# EAGLE schematic schematic (EAGLE 9.7.0)
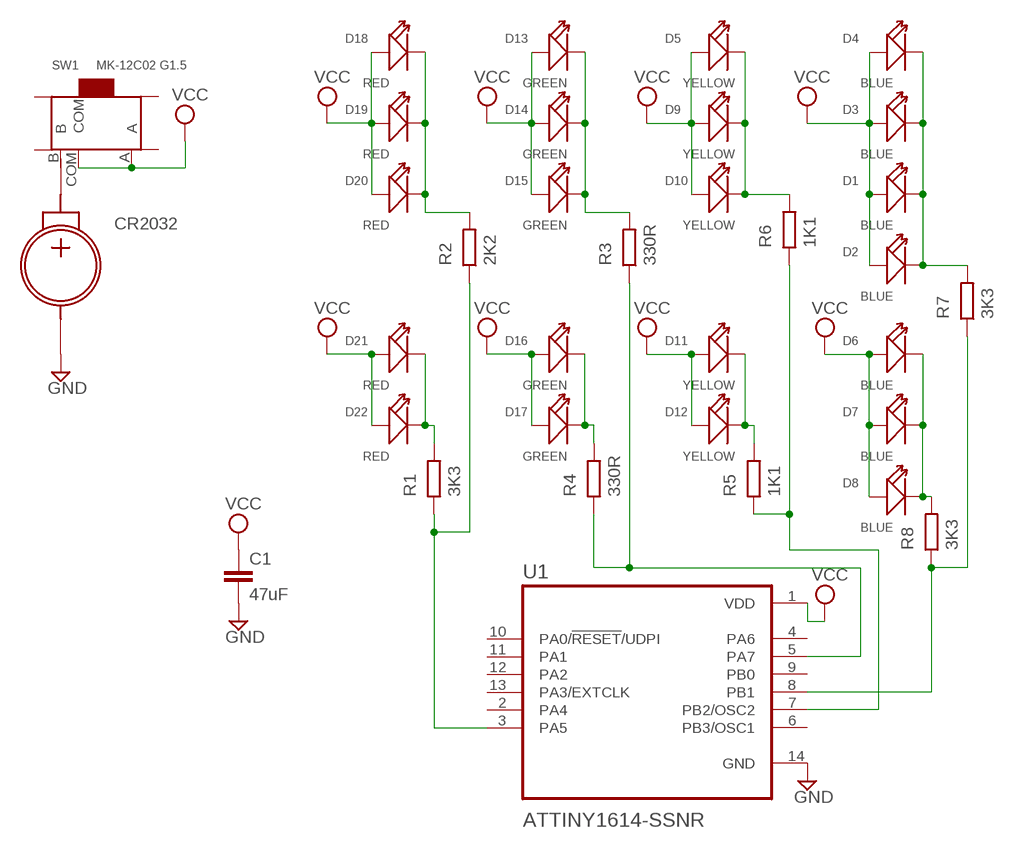
[diagram p0: schematic, sheet 1]

## Parts
C1  47uF  C-EUC1206  [C1206]
CR2032  BS-7CR2032_COIN_CELL_BATTERY_HOLDER  [BS-7]
D1  BLUE  DIP-LED-GREEN-GREEN(2P-D3MM)  [LED2-2.54-D3.0MM]
D2  BLUE  DIP-LED-GREEN-GREEN(2P-D3MM)  [LED2-2.54-D3.0MM]
D3  BLUE  DIP-LED-GREEN-GREEN(2P-D3MM)  [LED2-2.54-D3.0MM]
D4  BLUE  DIP-LED-GREEN-GREEN(2P-D3MM)  [LED2-2.54-D3.0MM]
D5  YELLOW  DIP-LED-GREEN-GREEN(2P-D3MM)  [LED2-2.54-D3.0MM]
D6  BLUE  DIP-LED-GREEN-GREEN(2P-D3MM)  [LED2-2.54-D3.0MM]
D7  BLUE  DIP-LED-GREEN-GREEN(2P-D3MM)  [LED2-2.54-D3.0MM]
D8  BLUE  DIP-LED-GREEN-GREEN(2P-D3MM)  [LED2-2.54-D3.0MM]
D9  YELLOW  DIP-LED-GREEN-GREEN(2P-D3MM)  [LED2-2.54-D3.0MM]
D10  YELLOW  DIP-LED-GREEN-GREEN(2P-D3MM)  [LED2-2.54-D3.0MM]
D11  YELLOW  DIP-LED-GREEN-GREEN(2P-D3MM)  [LED2-2.54-D3.0MM]
D12  YELLOW  DIP-LED-GREEN-GREEN(2P-D3MM)  [LED2-2.54-D3.0MM]
D13  GREEN  DIP-LED-GREEN-GREEN(2P-D3MM)  [LED2-2.54-D3.0MM]
D14  GREEN  DIP-LED-GREEN-GREEN(2P-D3MM)  [LED2-2.54-D3.0MM]
D15  GREEN  DIP-LED-GREEN-GREEN(2P-D3MM)  [LED2-2.54-D3.0MM]
D16  GREEN  DIP-LED-GREEN-GREEN(2P-D3MM)  [LED2-2.54-D3.0MM]
D17  GREEN  DIP-LED-GREEN-GREEN(2P-D3MM)  [LED2-2.54-D3.0MM]
D18  RED  DIP-LED-GREEN-GREEN(2P-D3MM)  [LED2-2.54-D3.0MM]
D19  RED  DIP-LED-GREEN-GREEN(2P-D3MM)  [LED2-2.54-D3.0MM]
D20  RED  DIP-LED-GREEN-GREEN(2P-D3MM)  [LED2-2.54-D3.0MM]
D21  RED  DIP-LED-GREEN-GREEN(2P-D3MM)  [LED2-2.54-D3.0MM]
D22  RED  DIP-LED-GREEN-GREEN(2P-D3MM)  [LED2-2.54-D3.0MM]
R1  3K3  R_AXIAL-7.2MM-PITCH  [RESAD724W46L381D178B]
R2  2K2  R_AXIAL-7.2MM-PITCH  [RESAD724W46L381D178B]
R3  330R  R_AXIAL-7.2MM-PITCH  [RESAD724W46L381D178B]
R4  330R  R_AXIAL-7.2MM-PITCH  [RESAD724W46L381D178B]
R5  1K1  R_AXIAL-7.2MM-PITCH  [RESAD724W46L381D178B]
R6  1K1  R_AXIAL-7.2MM-PITCH  [RESAD724W46L381D178B]
R7  3K3  R_AXIAL-7.2MM-PITCH  [RESAD724W46L381D178B]
R8  3K3  R_AXIAL-7.2MM-PITCH  [RESAD724W46L381D178B]
SW1  MK-12C02 G1.5  SMD-TOGGLE-SWITCH-ON-ON(3+4P-6.7X2.7MM)  [SW7-SMD-L6.7X2.7X3.2MM]
U1  ATTINY1614-SSNR  [SOIC127P600X175-14N]

## Nets
GND: C1.2 CR2032.NEG U1.14(GND)
N$1: D13.K(-) D14.K(-) D15.K(-) R3.2
N$2: D21.K(-) D22.K(-) R1.2
N$3: R1.1 R2.1 U1.3(PA5)
N$4: D18.K(-) D19.K(-) D20.K(-) R2.2
N$5: R3.1 R4.1 U1.5(PA7)
N$6: D16.K(-) D17.K(-) R4.2
N$7: D5.K(-) D9.K(-) D10.K(-) R6.2
N$8: D11.K(-) D12.K(-) R5.2
N$9: R5.1 R6.1 U1.7(PB2/OSC2)
N$10: D6.K(-) D7.K(-) D8.K(-) R8.2
N$11: D1.K(-) D2.K(-) D3.K(-) D4.K(-) R7.2
N$12: R7.1 R8.1 U1.8(PB1)
VCC: C1.1 D1.A(+) D2.A(+) D3.A(+) D4.A(+) D5.A(+) D6.A(+) D7.A(+) D8.A(+) D9.A(+) D10.A(+) D11.A(+) D12.A(+) D13.A(+) D14.A(+) D15.A(+) D16.A(+) D17.A(+) D18.A(+) D19.A(+) D20.A(+) D21.A(+) D22.A(+) SW1.A SW1.COM U1.1(VDD)
Unconnected: SW1.B SW1.SS1 SW1.SS2 SW1.SS3 SW1.SS4 U1.2(PA4) U1.4(PA6) U1.6(PB3/OSC1) U1.9(PB0) U1.10(PA0/!RESET!/UDPI) U1.11(PA1) U1.12(PA2) U1.13(PA3/EXTCLK)

## Power pins joined to a net without a drawn wire
POS: CR2032.POS

## Library data of the parts
C1 = rcl:C-EU: CAPACITOR, European symbol; SPICEPREFIX: C
CR2032 = CR2032_coin_cell_battery_holder:BS-7; AVAILABILITY: Unavailable; DESCRIPTION: CR2032 holder, battery rel; MF: MPD; MP: BS-7; PACKAGE: None; PRICE: None
D1-D22 = OPL_Optoelectronics:DIP-LED-GREEN-GREEN(2P-D3MM): 304090040; MPN: CX-G302DC; VALUE: CX-G302DC
R1-R8 = Resistor:R: Resistor Fixed - Generic; CATEGORY: Resistor; SUB-CATEGORY: Fixed
SW1 = OPL_Switch:SMD-TOGGLE-SWITCH-ON-ON(3+4P-6.7X2.7MM): 311030001; MPN: MK-12C02 G1.5
U1 = ATTINY1614-SSNR:ATTINY1614-SSNR: 20MHz, SOIC, 85C, Green, 14 SOIC .150in T/R; AVAILABILITY: Unavailable; DESCRIPTION: 20MHz, SOIC, 85C, Green, 14 SOIC .150in T/R; MF: Microchip; MP: ATTINY1614-SSNR; PACKAGE: SO-14 Microchip; PRICE: None